# Altium project Tray2.PrjPcb
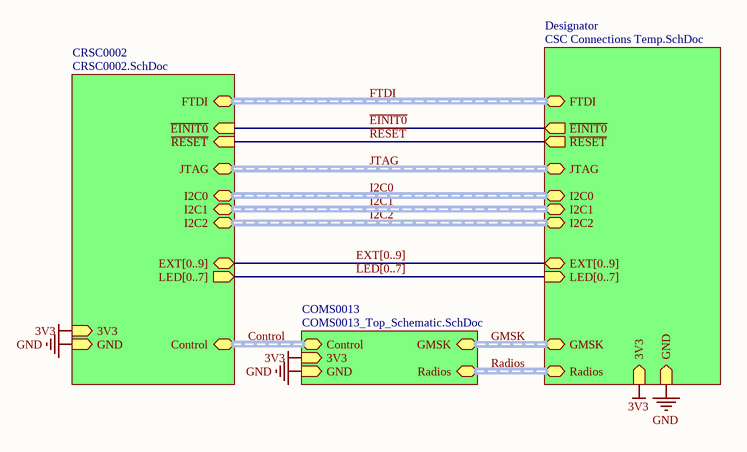
[diagram p0: Tray2.SchDoc]
8 sheets, 140 parts. Net scope: strictly hierarchical (ports join the sheet entries above them; power ports are local).
Board file: CSC 002B.PcbDoc
Sheets:
  Tray2.SchDoc
    CRSC0002 = CRSC0002.SchDoc
    COMS0013 = COMS0013_Top_Schematic.SchDoc
      D1 = COMS0003_DTMF.SchDoc
      D2 = COMS0003_DTMF.SchDoc
      Beacon = COMS0001_Beacon.SchDoc
      U_SwC_Main = COMS0004 SwC_Main.SchDoc
      A1 = COMS0002_AFSK.SchDoc
      A2 = COMS0002_AFSK.SchDoc
    Designator = CSC Connections Temp.SchDoc

## Sheet Tray2.SchDoc
size A4

### Sub-sheets
COMS0013 = COMS0013_Top_Schematic.SchDoc: GMSK (harness GMSK), Radios (harness Radios), Control (harness CommsControl), 3V3 (in), GND (in)
CRSC0002 = CRSC0002.SchDoc: ~{EINIT0} (in), ~{RESET} (in), I2C1 (harness I2C), I2C0 (harness I2C), I2C2 (harness I2C), JTAG (harness JTAG), Control (harness CommsControl), FTDI (harness FTDI), EXT[0..9] (bidir), LED[0..7] (out), 3V3 (in), GND (in)
Designator = CSC Connections Temp.SchDoc: JTAG (harness JTAG), FTDI (harness FTDI), I2C0 (harness I2C), I2C1 (harness I2C), I2C2 (harness I2C), GMSK (harness GMSK), Radios (harness Radios), ~{RESET} (out), ~{EINIT0} (out), LED[0..7] (in), EXT[0..9] (bidir), 3V3 (in), GND (in)

### Nets
3V3: sheet CRSC0002/3V3, sheet COMS0013/3V3, sheet Designator/3V3
GND: sheet CRSC0002/GND, sheet COMS0013/GND, sheet Designator/GND
~{EINIT0}: sheet CRSC0002/~{EINIT0}, sheet Designator/~{EINIT0}
~{RESET}: sheet CRSC0002/~{RESET}, sheet Designator/~{RESET}

### Buses and harness runs
bus EXT[0..9] = sheet CRSC0002/EXT[0..9] = sheet Designator/EXT[0..9]
bus LED[0..7] = sheet CRSC0002/LED[0..7] = sheet Designator/LED[0..7]
harness Control = sheet COMS0013/Control = sheet CRSC0002/Control
harness FTDI = sheet CRSC0002/FTDI = sheet Designator/FTDI
harness GMSK = sheet COMS0013/GMSK = sheet Designator/GMSK
harness I2C0 = sheet CRSC0002/I2C0 = sheet Designator/I2C0
harness I2C1 = sheet CRSC0002/I2C1 = sheet Designator/I2C1
harness I2C2 = sheet CRSC0002/I2C2 = sheet Designator/I2C2
harness JTAG = sheet CRSC0002/JTAG = sheet Designator/JTAG
harness Radios = sheet COMS0013/Radios = sheet Designator/Radios

## Sheet CRSC0002.SchDoc
size A3; PageSetup: Record=PageOptions|CenterHorizontal=True|CenterVertical=True|PrintScale=0.97|XCorrection=1.00|YCorrection=1.00|PrintKind=1|BorderSize=5000000|LeftOffset=0|BottomOffset=0|Orientation=2|PaperLength=2970|PaperWidth=2100|Scale=100|PaperSource=7|PrintQuality=1200|MediaType=1|DitherType=10|PaperKind=A4|PrintScaleMode=1
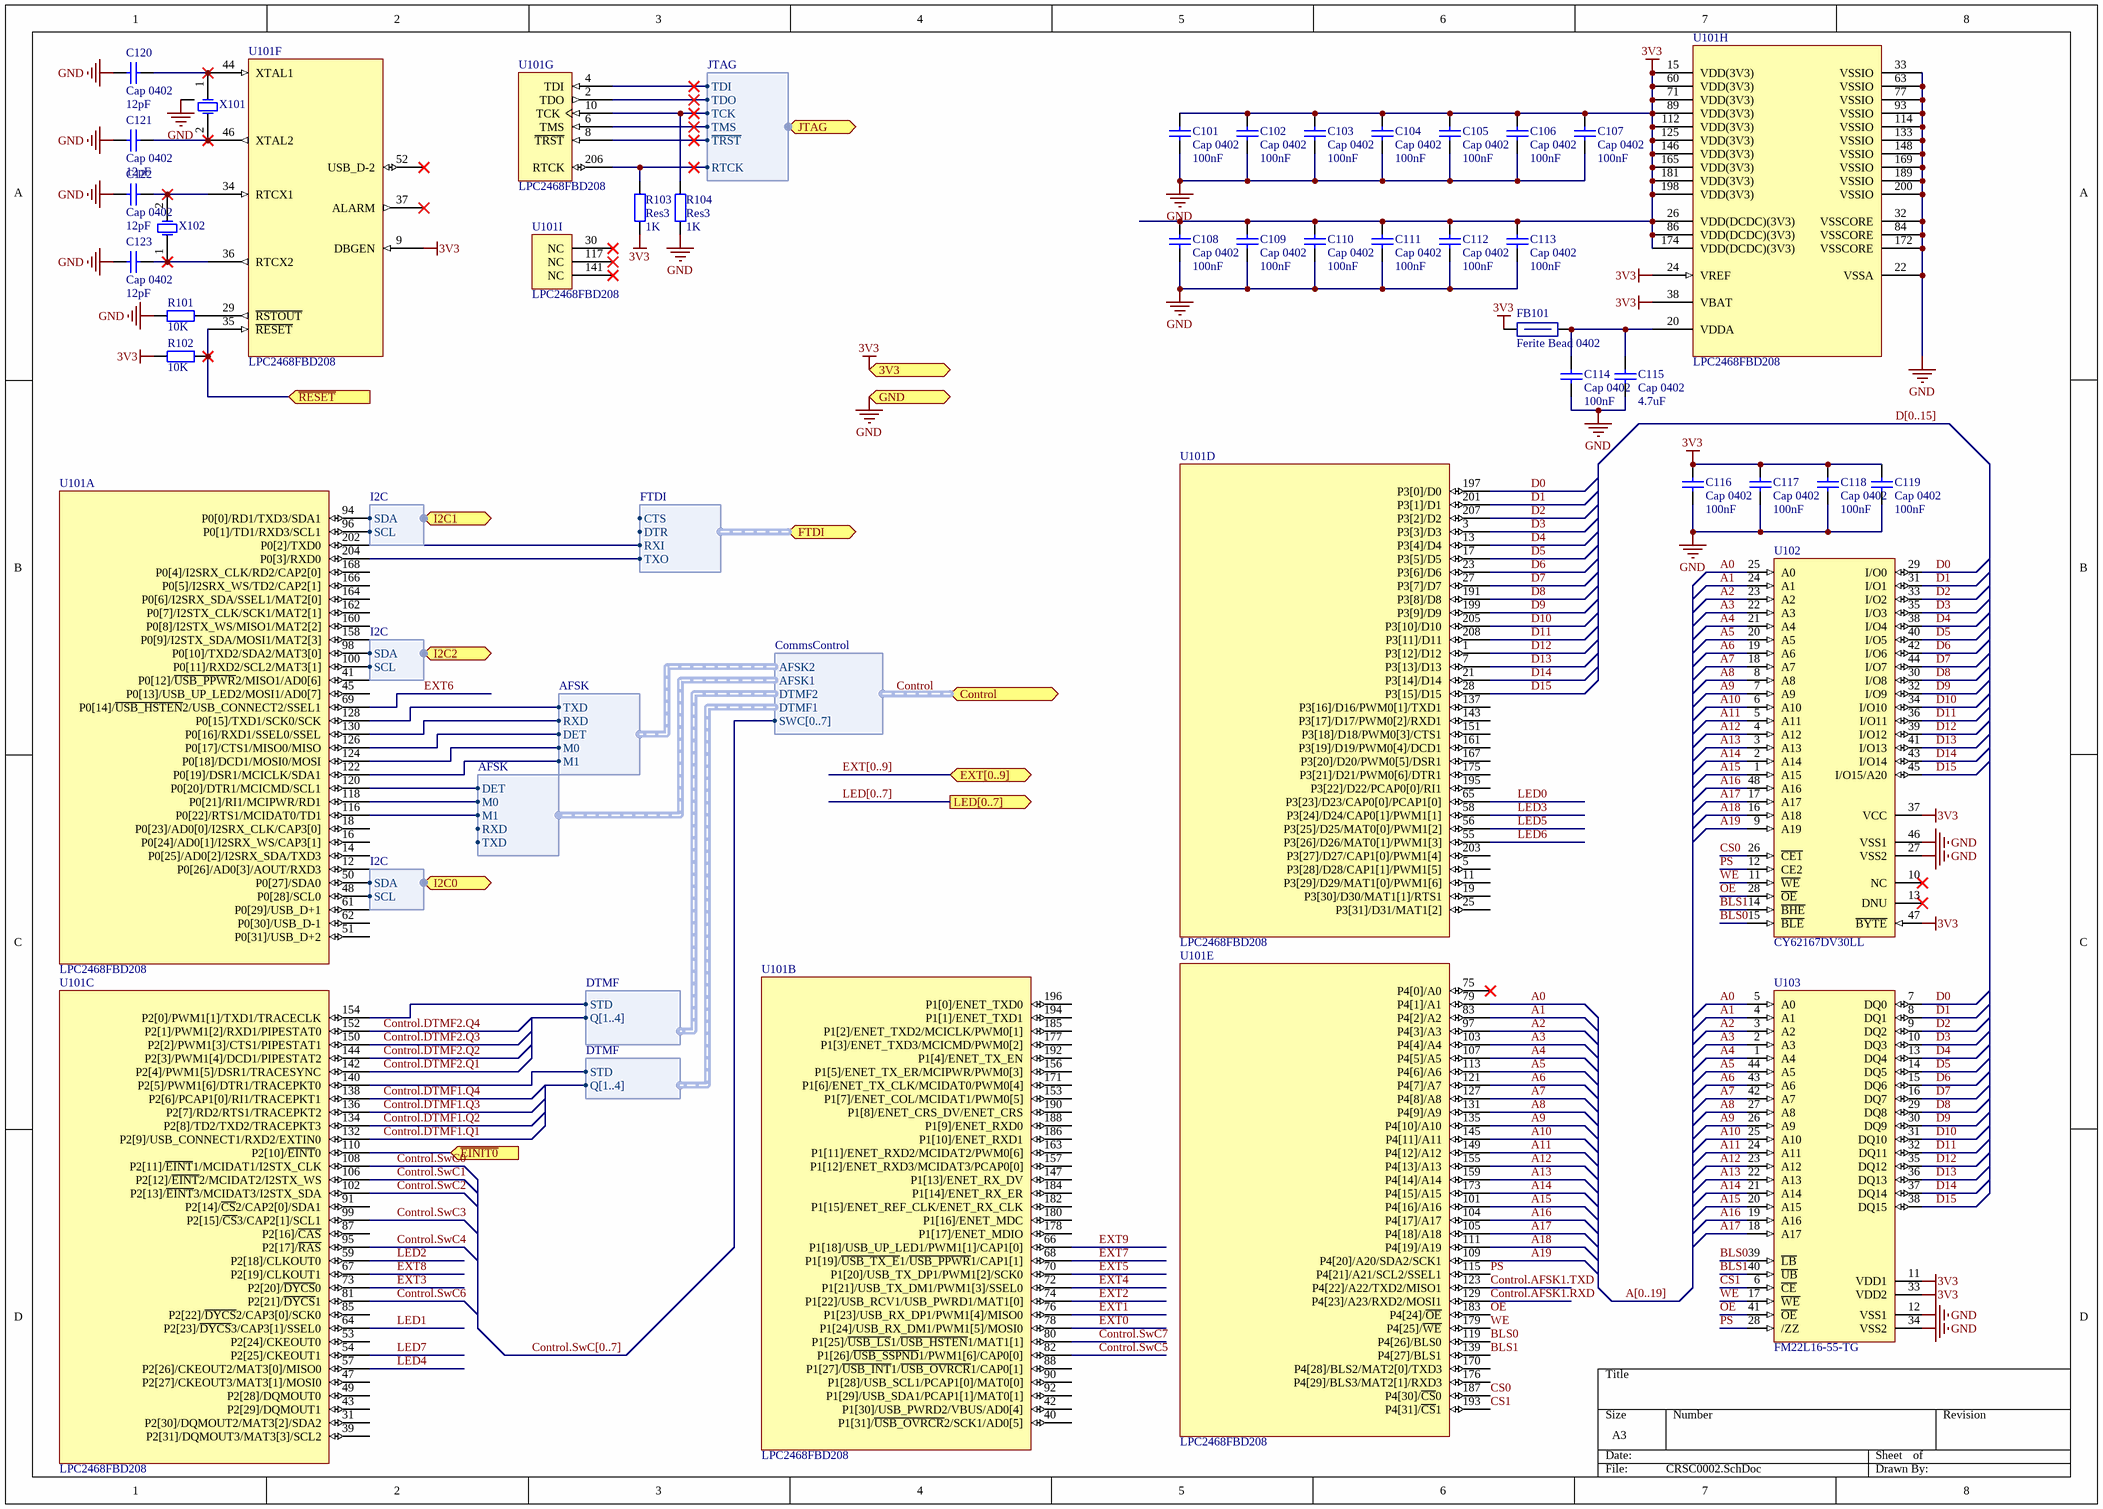
[diagram p1: CRSC0002.SchDoc]

### Parts
C101  Cap 0402  value 100nF  [CAPC1005X06L]
C102  Cap 0402  value 100nF  [CAPC1005X06L]
C103  Cap 0402  value 100nF  [CAPC1005X06L]
C104  Cap 0402  value 100nF  [CAPC1005X06L]
C105  Cap 0402  value 100nF  [CAPC1005X06L]
C106  Cap 0402  value 100nF  [CAPC1005X06L]
C107  Cap 0402  value 100nF  [CAPC1005X06L]
C108  Cap 0402  value 100nF  [CAPC1005X06L]
C109  Cap 0402  value 100nF  [CAPC1005X06L]
C110  Cap 0402  value 100nF  [CAPC1005X06L]
C111  Cap 0402  value 100nF  [CAPC1005X06L]
C112  Cap 0402  value 100nF  [CAPC1005X06L]
C113  Cap 0402  value 100nF  [CAPC1005X06L]
C114  Cap 0402  value 100nF  [CAPC1005X06L]
C115  Cap 0402  value 4.7uF  [CAPC1005X06L]
C116  Cap 0402  value 100nF  [CAPC1005X06L]
C117  Cap 0402  value 100nF  [CAPC1005X06L]
C118  Cap 0402  value 100nF  [CAPC1005X06L]
C119  Cap 0402  value 100nF  [CAPC1005X06L]
C120  Cap 0402  value 12pF  [CAPC1005X06L]
C121  Cap 0402  value 12pF  [CAPC1005X06L]
C122  Cap 0402  value 12pF  [CAPC1005X06L]
C123  Cap 0402  value 12pF  [CAPC1005X06L]
FB101  Ferite Bead 0402  [INDC1005X06L]
R101  value 10K  [RESC1005X06L]  (hidden comment: Res3)
R102  value 10K  [RESC1005X06L]  (hidden comment: Res3)
R103  Res3  value 1K  [RESC1005X06L]
R104  Res3  value 1K  [RESC1005X06L]
U101  LPC2468FBD208  [TSQFP50P3000X3000X160-208L]  (parts A,B,C,D,E,F,G,H,I of 9)
U102  CY62167DV30LL  [TSSOP50P2000X120-48L]
U103  FM22L16-55-TG  [TSOP80P1180X120-44L]
X101  Crystal Oscilator  [7M]  (value not drawn)
X102  Crystal Oscilator  [9H T10]  (value not drawn)

### Ports
3V3 (in), Control (harness CommsControl), EXT[0..9] (bidir), FTDI (harness FTDI), GND (in), I2C0 (harness I2C), I2C1 (harness I2C), I2C2 (harness I2C), JTAG (harness JTAG), LED[0..7] (out), ~{EINIT0} (in), ~{RESET} (in)

### Harnesses
I2C: SDA, SCL
JTAG: TDI, TDO, TCK, TMS, ~{TRST}, RTCK
AFSK: DET, M0, M1, RXD, TXD
DTMF: Q[1..4], STD
CommsControl: AFSK1, AFSK2, DTMF1, DTMF2, SWC[0..7]
FTDI: CTS, DTR, RXI, TXO

### Nets
3V3: C101.2 C102.2 C103.2 C104.2 C105.2 C106.2 C107.2 C108.2 C109.2 C110.2 C111.2 C112.2 C113.2 C116.2 C117.2 C118.2 C119.2 FB101.1 R102.2 R103.2 U101.9(DBGEN) U101.15(VDD(3V3)) U101.24(VREF) U101.26(VDD(DCDC)(3V3)) U101.38(VBAT) U101.60(VDD(3V3)) U101.71(VDD(3V3)) U101.86(VDD(DCDC)(3V3)) U101.89(VDD(3V3)) U101.112(VDD(3V3)) U101.125(VDD(3V3)) U101.146(VDD(3V3)) U101.165(VDD(3V3)) U101.174(VDD(DCDC)(3V3)) U101.181(VDD(3V3)) U101.198(VDD(3V3)) U102.37(VCC) U102.47(~{BYTE}) U103.11(VDD1) U103.33(VDD2) ; port 3V3
GND: C101.1 C102.1 C103.1 C104.1 C105.1 C106.1 C107.1 C108.1 C109.1 C110.1 C111.1 C112.1 C113.1 C114.1 C115.1 C116.1 C117.1 C118.1 C119.1 C120.2 C121.1 C122.2 C123.1 R101.2 R104.2 U101.22(VSSA) U101.32(VSSCORE) U101.33(VSSIO) U101.63(VSSIO) U101.77(VSSIO) U101.84(VSSCORE) U101.93(VSSIO) U101.114(VSSIO) U101.133(VSSIO) U101.148(VSSIO) U101.169(VSSIO) U101.172(VSSCORE) U101.189(VSSIO) U101.200(VSSIO) U102.27(VSS2) U102.46(VSS1) U103.12(VSS1) U103.34(VSS2) X101.3 ; port GND
A0: U101.79(P4[1]/A1) U102.25(A0) U103.5(A0)
A1: U101.83(P4[2]/A2) U102.24(A1) U103.4(A1)
A2: U101.97(P4[3]/A3) U102.23(A2) U103.3(A2)
A3: U101.103(P4[4]/A4) U102.22(A3) U103.2(A3)
A4: U101.107(P4[5]/A5) U102.21(A4) U103.1(A4)
A5: U101.113(P4[6]/A6) U102.20(A5) U103.44(A5)
A6: U101.121(P4[7]/A7) U102.19(A6) U103.43(A6)
A7: U101.127(P4[8]/A8) U102.18(A7) U103.42(A7)
A8: U101.131(P4[9]/A9) U102.8(A8) U103.27(A8)
A9: U101.135(P4[10]/A10) U102.7(A9) U103.26(A9)
A10: U101.145(P4[11]/A11) U102.6(A10) U103.25(A10)
A11: U101.149(P4[12]/A12) U102.5(A11) U103.24(A11)
A12: U101.155(P4[13]/A13) U102.4(A12) U103.23(A12)
A13: U101.159(P4[14]/A14) U102.3(A13) U103.22(A13)
A14: U101.173(P4[15]/A15) U102.2(A14) U103.21(A14)
A15: U101.101(P4[16]/A16) U102.1(A15) U103.20(A15)
A16: U101.104(P4[17]/A17) U102.48(A16) U103.19(A16)
A17: U101.105(P4[18]/A18) U102.17(A17) U103.18(A17)
A18: U101.111(P4[19]/A19) U102.16(A18)
A19: U101.109(P4[20]/A20/SDA2/SCK1) U102.9(A19)
BLS0: U101.119(P4[26]/BLS0) U102.15(~{BLE}) U103.39(~{LB})
BLS1: U101.139(P4[27]/BLS1) U102.14(~{BHE}) U103.40(~{UB})
Control.AFSK1.RXD: U101.129(P4[23]/A23/RXD2/MOSI1)
Control.AFSK1.TXD: U101.123(P4[22]/A22/TXD2/MISO1)
Control.DTMF1.Q1: U101.132(P2[9]/USB_CONNECT1/RXD2/EXTIN0)
Control.DTMF1.Q2: U101.134(P2[8]/TD2/TXD2/TRACEPKT3)
Control.DTMF1.Q3: U101.136(P2[7]/RD2/RTS1/TRACEPKT2)
Control.DTMF1.Q4: U101.138(P2[6]/PCAP1[0]/RI1/TRACEPKT1)
Control.DTMF2.Q1: U101.142(P2[4]/PWM1[5]/DSR1/TRACESYNC)
Control.DTMF2.Q2: U101.144(P2[3]/PWM1[4]/DCD1/PIPESTAT2)
Control.DTMF2.Q3: U101.150(P2[2]/PWM1[3]/CTS1/PIPESTAT1)
Control.DTMF2.Q4: U101.152(P2[1]/PWM1[2]/RXD1/PIPESTAT0)
Control.SwC0: U101.108(P2[11]/~{EINT}1/MCIDAT1/I2STX_CLK)
Control.SwC1: U101.106(P2[12]/~{EINT}2/MCIDAT2/I2STX_WS)
Control.SwC2: U101.102(P2[13]/~{EINT}3/MCIDAT3/I2STX_SDA)
Control.SwC3: U101.99(P2[15]/~{CS}3/CAP2[1]/SCL1)
Control.SwC4: U101.95(P2[17]/~{RAS})
Control.SwC5: U101.82(P1[26]/~{USB_SSPND}1/PWM1[6]/CAP0[0])
Control.SwC6: U101.81(P2[21]/~{DYCS}1)
Control.SwC7: U101.80(P1[25]/~{USB_LS}1/~{USB_HSTEN}1/MAT1[1])
CS0: U101.187(P4[30]/~{CS}0) U102.26(~{CE1})
CS1: U101.193(P4[31]/~{CS}1) U103.6(~{CE})
D0: U101.197(P3[0]/D0) U102.29(I/O0) U103.7(DQ0)
D1: U101.201(P3[1]/D1) U102.31(I/O1) U103.8(DQ1)
D2: U101.207(P3[2]/D2) U102.33(I/O2) U103.9(DQ2)
D3: U101.3(P3[3]/D3) U102.35(I/O3) U103.10(DQ3)
D4: U101.13(P3[4]/D4) U102.38(I/O4) U103.13(DQ4)
D5: U101.17(P3[5]/D5) U102.40(I/O5) U103.14(DQ5)
D6: U101.23(P3[6]/D6) U102.42(I/O6) U103.15(DQ6)
D7: U101.27(P3[7]/D7) U102.44(I/O7) U103.16(DQ7)
D8: U101.191(P3[8]/D8) U102.30(I/O8) U103.29(DQ8)
D9: U101.199(P3[9]/D9) U102.32(I/O9) U103.30(DQ9)
D10: U101.205(P3[10]/D10) U102.34(I/O10) U103.31(DQ10)
D11: U101.208(P3[11]/D11) U102.36(I/O11) U103.32(DQ11)
D12: U101.1(P3[12]/D12) U102.39(I/O12) U103.35(DQ12)
D13: U101.7(P3[13]/D13) U102.41(I/O13) U103.36(DQ13)
D14: U101.21(P3[14]/D14) U102.43(I/O14) U103.37(DQ14)
D15: U101.28(P3[15]/D15) U102.45(I/O15/A20) U103.38(DQ15)
DTMF.STD: U101.154(P2[0]/PWM1[1]/TXD1/TRACECLK) ; harness DTMF.STD
DTMF.STD: U101.140(P2[5]/PWM1[6]/DTR1/TRACEPKT0) ; harness DTMF.STD  [a separate net that carries the same name]
~{EINIT0}: U101.110(P2[10]/~{EINT}0) ; port ~{EINIT0}
EXT0: U101.78(P1[24]/USB_RX_DM1/PWM1[5]/MOSI0)
EXT1: U101.76(P1[23]/USB_RX_DP1/PWM1[4]/MISO0)
EXT2: U101.74(P1[22]/USB_RCV1/USB_PWRD1/MAT1[0])
EXT3: U101.73(P2[20]/~{DYCS}0)
EXT4: U101.72(P1[21]/USB_TX_DM1/PWM1[3]/SSEL0)
EXT5: U101.70(P1[20]/USB_TX_DP1/PWM1[2]/SCK0)
EXT6: U101.69(P0[14]/~{USB_HSTEN}2/USB_CONNECT2/SSEL1)
EXT7: U101.68(P1[19]/~{USB_TX_E}1/~{USB_PPWR}1/CAP1[1])
EXT8: U101.67(P2[19]/CLKOUT1)
EXT9: U101.66(P1[18]/USB_UP_LED1/PWM1[1]/CAP1[0])
FTDI.RXI: U101.202(P0[2]/TXD0) ; port FTDI.RXI
FTDI.TXO: U101.204(P0[3]/RXD0) ; port FTDI.TXO
I2C0.SCL: U101.48(P0[28]/SCL0) ; port I2C0.SCL
I2C0.SDA: U101.50(P0[27]/SDA0) ; port I2C0.SDA
I2C1.SCL: U101.96(P0[1]/TD1/RXD3/SCL1) ; port I2C1.SCL
I2C1.SDA: U101.94(P0[0]/RD1/TXD3/SDA1) ; port I2C1.SDA
I2C2.SCL: U101.100(P0[11]/RXD2/SCL2/MAT3[1]) ; port I2C2.SCL
I2C2.SDA: U101.98(P0[10]/TXD2/SDA2/MAT3[0]) ; port I2C2.SDA
JTAG.RTCK: R103.1 U101.206(RTCK) ; port JTAG.RTCK
JTAG.~{TRST}: U101.8(~{TRST}) ; port JTAG.~{TRST}
JTAG.TCK: R104.1 U101.10(TCK) ; port JTAG.TCK
JTAG.TDI: U101.4(TDI) ; port JTAG.TDI
JTAG.TDO: U101.2(TDO) ; port JTAG.TDO
JTAG.TMS: U101.6(TMS) ; port JTAG.TMS
LED0: U101.65(P3[23]/D23/CAP0[0]/PCAP1[0])
LED1: U101.64(P2[23]/~{DYCS}3/CAP3[1]/SSEL0)
LED2: U101.59(P2[18]/CLKOUT0)
LED3: U101.58(P3[24]/D24/CAP0[1]/PWM1[1])
LED4: U101.57(P2[26]/CKEOUT2/MAT3[0]/MISO0)
LED5: U101.56(P3[25]/D25/MAT0[0]/PWM1[2])
LED6: U101.55(P3[26]/D26/MAT0[1]/PWM1[3])
LED7: U101.54(P2[25]/CKEOUT1)
OE: U101.183(P4[24]/~{OE}) U102.28(~{OE}) U103.41(~{OE})
PS: U101.115(P4[21]/A21/SCL2/SSEL1) U102.12(CE2) U103.28(/ZZ)
~{RESET}: R102.1 U101.35(~{RESET}) ; port ~{RESET}
WE: U101.179(P4[25]/~{WE}) U102.11(~{WE}) U103.17(~{WE})
NetC114_2: C114.2 C115.2 FB101.2 U101.20(VDDA)
NetC120_1: C120.1 U101.44(XTAL1) X101.1(OSC1)
NetC121_2: C121.2 U101.46(XTAL2) X101.2(OSC2)
NetC122_1: C122.1 U101.34(RTCX1) X102.2(OSC2)
NetC123_2: C123.2 U101.36(RTCX2) X102.1(OSC1)
NetR101_1: R101.1 U101.29(~{RSTOUT})
NetU101_116: U101.116(P0[22]/RTS1/MCIDAT0/TD1) ; harness AFSK.M1
NetU101_118: U101.118(P0[21]/RI1/MCIPWR/RD1) ; harness AFSK.M0
NetU101_120: U101.120(P0[20]/DTR1/MCICMD/SCL1) ; harness AFSK.DET
NetU101_122: U101.122(P0[19]/DSR1/MCICLK/SDA1) ; harness AFSK.M1
NetU101_124: U101.124(P0[18]/DCD1/MOSI0/MOSI) ; harness AFSK.M0
NetU101_126: U101.126(P0[17]/CTS1/MISO0/MISO) ; harness AFSK.DET
NetU101_128: U101.128(P0[15]/TXD1/SCK0/SCK) ; harness AFSK.TXD
NetU101_130: U101.130(P0[16]/RXD1/SSEL0/SSEL) ; harness AFSK.RXD

Not connected (* = marked no-connect by the designer): U101 5(P3[28]/D28/CAP1[1]/PWM1[5]) 11(P3[29]/D29/MAT1[0]/PWM1[6]) 12(P0[26]/AD0[3]/AOUT/RXD3) 14(P0[25]/AD0[2]/I2SRX_SDA/TXD3) 16(P0[24]/AD0[1]/I2SRX_WS/CAP3[1]) 18(P0[23]/AD0[0]/I2SRX_CLK/CAP3[0]) 19(P3[30]/D30/MAT1[1]/RTS1) 25(P3[31]/D31/MAT1[2]) 30(NC)* 31(P2[30]/DQMOUT2/MAT3[2]/SDA2) 37(ALARM)* 39(P2[31]/DQMOUT3/MAT3[3]/SCL2) 40(P1[31]/~{USB_OVRCR}2/SCK1/AD0[5]) 41(P0[12]/~{USB_PPWR}2/MISO1/AD0[6]) 42(P1[30]/USB_PWRD2/VBUS/AD0[4]) 43(P2[29]/DQMOUT1) 45(P0[13]/USB_UP_LED2/MOSI1/AD0[7]) 47(P2[27]/CKEOUT3/MAT3[1]/MOSI0) 49(P2[28]/DQMOUT0) 51(P0[31]/USB_D+2) 52(USB_D-2)* 53(P2[24]/CKEOUT0) 61(P0[29]/USB_D+1) 62(P0[30]/USB_D-1) 75(P4[0]/A0)* 85(P2[22]/~{DYCS}2/CAP3[0]/SCK0) 87(P2[16]/~{CAS}) 88(P1[27]/~{USB_INT}1/~{USB_OVRCR}1/CAP0[1]) 90(P1[28]/USB_SCL1/PCAP1[0]/MAT0[0]) 91(P2[14]/~{CS}2/CAP2[0]/SDA1) 92(P1[29]/USB_SDA1/PCAP1[1]/MAT0[1]) 117(NC)* 137(P3[16]/D16/PWM0[1]/TXD1) 141(NC)* 143(P3[17]/D17/PWM0[2]/RXD1) 147(P1[13]/ENET_RX_DV) 151(P3[18]/D18/PWM0[3]/CTS1) 153(P1[7]/ENET_COL/MCIDAT1/PWM0[5]) 156(P1[5]/ENET_TX_ER/MCIPWR/PWM0[3]) 157(P1[12]/ENET_RXD3/MCIDAT3/PCAP0[0]) 158(P0[9]/I2STX_SDA/MOSI1/MAT2[3]) 160(P0[8]/I2STX_WS/MISO1/MAT2[2]) 161(P3[19]/D19/PWM0[4]/DCD1) 162(P0[7]/I2STX_CLK/SCK1/MAT2[1]) 163(P1[11]/ENET_RXD2/MCIDAT2/PWM0[6]) 164(P0[6]/I2SRX_SDA/SSEL1/MAT2[0]) 166(P0[5]/I2SRX_WS/TD2/CAP2[1]) 167(P3[20]/D20/PWM0[5]/DSR1) 168(P0[4]/I2SRX_CLK/RD2/CAP2[0]) 170(P4[28]/BLS2/MAT2[0]/TXD3) 171(P1[6]/ENET_TX_CLK/MCIDAT0/PWM0[4]) 175(P3[21]/D21/PWM0[6]/DTR1) 176(P4[29]/BLS3/MAT2[1]/RXD3) 177(P1[3]/ENET_TXD3/MCICMD/PWM0[2]) 178(P1[17]/ENET_MDIO) 180(P1[16]/ENET_MDC) 182(P1[15]/ENET_REF_CLK/ENET_RX_CLK) 184(P1[14]/ENET_RX_ER) 185(P1[2]/ENET_TXD2/MCICLK/PWM0[1]) 186(P1[10]/ENET_RXD1) 188(P1[9]/ENET_RXD0) 190(P1[8]/ENET_CRS_DV/ENET_CRS) 192(P1[4]/ENET_TX_EN) 194(P1[1]/ENET_TXD1) 195(P3[22]/D22/PCAP0[0]/RI1) 196(P1[0]/ENET_TXD0) 203(P3[27]/D27/CAP1[0]/PWM1[4]); U102 10(NC)* 13(DNU)*

### Buses and harness runs
bus A[0..19]
bus Control.SwC[0..7]
bus D[0..15]
bus EXT[0..9] = port EXT[0..9]
bus LED[0..7] = port LED[0..7]
harness Control = port Control

### Library data of the parts
C101-C123 = Cap 0402: Capacitor; Published: 8-Jun-2000; LatestRevisionDate: 17-Jul-2002; LatestRevisionNote: Re-released for DXP Platform.; PackageReference: RAD-0.3; Publisher: Altium Limited; PackageDescription: Radial Cap, Thru-Hole; 2 Leads; 0.3 in Pin Spacing
FB101 = FB_0402: Ferite Bead : 0402; Published: 8-Jun-2000; LatestRevisionDate: 29-May-2009; LatestRevisionNote: IPC-7351 Footprint Added.; PackageReference: J1-0603; Publisher: Altium Limited; PackageDescription: Chip Resistor
R101-R104 = Res3: Resistor; Published: 8-Jun-2000; LatestRevisionDate: 29-May-2009; LatestRevisionNote: IPC-7351 Footprint Added.; PackageReference: J1-0603; Publisher: Altium Limited; PackageDescription: Chip Resistor
U101 = LPC2468FBD208: ARM7 16/32-Bit Microcontroller, 512KB Flash, 98KB RAM, 208-Lead LQFP; Code_IEC: 136E30; Published: 17-Aug-2007; DatasheetVersion: rev.01, Jul-2007; PackageVersion: Feb-2003; PackageReference: SOT459-1; Publisher: Altium Limited; PackageDescription: 208-Pin Plastic Low Profile Quad Flat Pack, LQFP208; Code_JEDEC: MS-026; ComponentLink1Description: Manufacturer Link; ComponentLink1URL: http://www.nxp.com/; ComponentLink2Description: Datasheet; ComponentLink2URL: http://www.standardics.nxp.com/products/lpc2000/datasheet/lpc2468.pdf
U102 = CY62167DV30LL: 16-Mbit (1M x 16) Static RAM; ColumnAddress: A0-A9; Publisher: Altium Limited; ComponentLink1Description: Manufacturer Link; ComponentLink2Description: Datasheet
U103 = FM22L16-55-TG: FRAM, 2MB, 3V, 60NS, 44TSOP2; ColumnAddress: A0-A9; LatestRevisionDate: 13-Apr-2006; DatasheetVersion: rev1.1, Feb-2004; PackageReference: TSOP2-44_M; PackageDescription: 44-Pin Small Outline Package 0.8 mm Pitch; ComponentLink1Description: Manufacturer Link; ComponentLink2Description: Datasheet
X101 = C.O. 4pins: Crystal Oscillator; Value: 12.000MHz; Published: 8-Jun-2000; LatestRevisionDate: 17-Jul-2002; LatestRevisionNote: Re-released for DXP Platform.; PackageReference: R38; Publisher: Altium Limited
X102 = C.O. 2pins: Crystal Oscillator; Value: 12.000MHz; Published: 8-Jun-2000; LatestRevisionDate: 17-Jul-2002; LatestRevisionNote: Re-released for DXP Platform.; PackageReference: R38; Publisher: Altium Limited

## Sheet COMS0013_Top_Schematic.SchDoc: Communications Top Level Schematic
size A3; Engineer: A. Shaw; DocumentNumber: COMS0013; Version: 1.0; Description: Overview of the communications subsystem
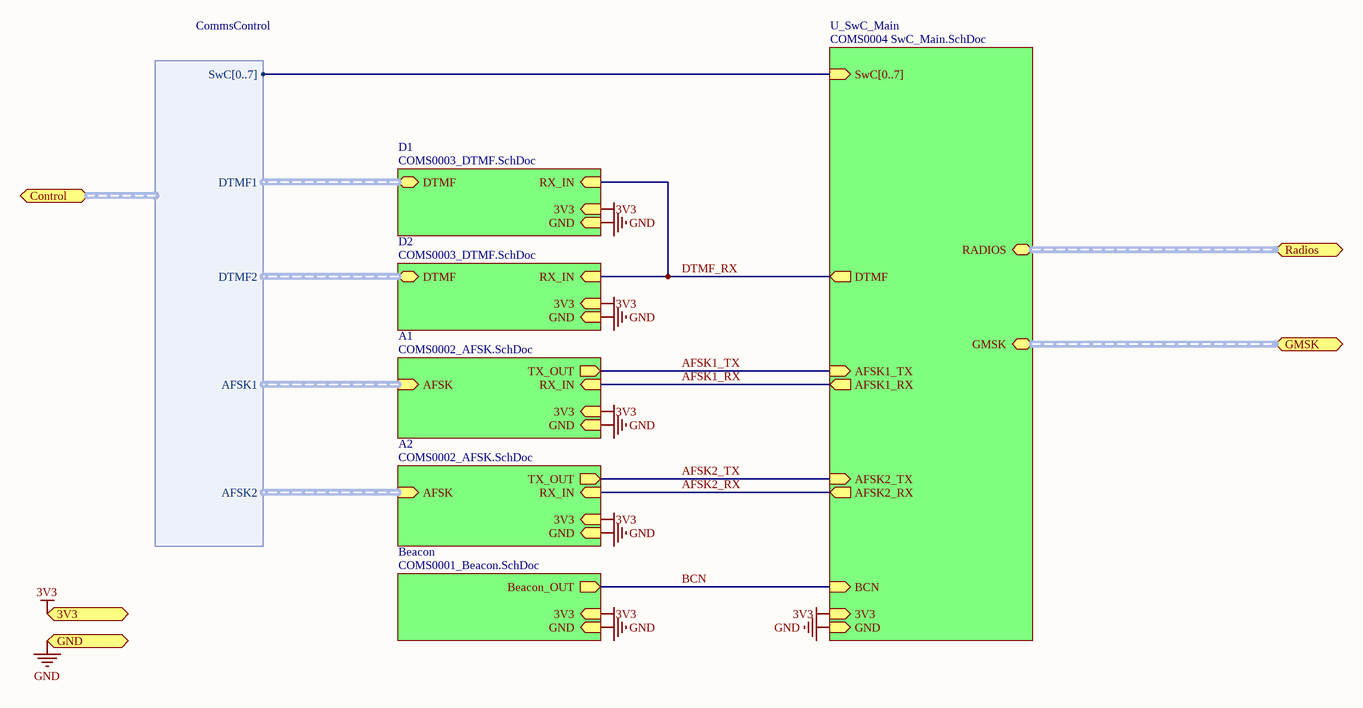
[diagram p2: COMS0013_Top_Schematic.SchDoc]

### Sub-sheets
A1 = COMS0002_AFSK.SchDoc: RX_IN (in), AFSK (harness AFSK), TX_OUT (out), 3V3 (in), GND (in)
A2 = COMS0002_AFSK.SchDoc: RX_IN (in), AFSK (harness AFSK), TX_OUT (out), 3V3 (in), GND (in)
Beacon = COMS0001_Beacon.SchDoc: Beacon_OUT (out), 3V3 (in), GND (in)
D1 = COMS0003_DTMF.SchDoc: RX_IN (in), DTMF (harness DTMF), 3V3 (in), GND (in)
D2 = COMS0003_DTMF.SchDoc: RX_IN (in), DTMF (harness DTMF), 3V3 (in), GND (in)
U_SwC_Main = COMS0004 SwC_Main.SchDoc: BCN (in), AFSK1_TX (in), AFSK2_TX (in), AFSK1_RX (out), AFSK2_RX (out), DTMF (out), SwC[0..7] (in), RADIOS (harness Radios), GMSK (harness GMSK), 3V3 (in), GND (in)

### Ports
3V3 (in), Control (harness CommsControl), GMSK (harness GMSK), GND (in), Radios (harness Radios)

### Harnesses
CommsControl: DTMF1, DTMF2, AFSK1, AFSK2, SwC[0..7]

### Nets
3V3: port 3V3, sheet D1/3V3, sheet D2/3V3, sheet Beacon/3V3, sheet U_SwC_Main/3V3, sheet A1/3V3, sheet A2/3V3
GND: port GND, sheet D1/GND, sheet D2/GND, sheet Beacon/GND, sheet U_SwC_Main/GND, sheet A1/GND, sheet A2/GND
AFSK1_RX: sheet U_SwC_Main/AFSK1_RX, sheet A1/RX_IN
AFSK1_TX: sheet U_SwC_Main/AFSK1_TX, sheet A1/TX_OUT
AFSK2_RX: sheet U_SwC_Main/AFSK2_RX, sheet A2/RX_IN
AFSK2_TX: sheet U_SwC_Main/AFSK2_TX, sheet A2/TX_OUT
BCN: sheet Beacon/Beacon_OUT, sheet U_SwC_Main/BCN
DTMF_RX: sheet D1/RX_IN, sheet D2/RX_IN, sheet U_SwC_Main/DTMF

### Buses and harness runs
harness port GMSK = sheet U_SwC_Main/GMSK
harness port Radios = sheet U_SwC_Main/RADIOS

### Notes on the sheet
- Title
- Description:
- Size:
- Author:
- Date:
- A3
- Time:
- Version
- Sheet:
- Drawing No.:
- of
- File:

## Sheet COMS0003_DTMF.SchDoc: BLUEsat DTMF receiver
size A3; DrawnBy: Thomas Fisk; Engineer: T. FISK; Organization: BLUEsat Project; Address1: Room 419; Address2: School of EE&T; Address3: UNSW, NSW 2052; Address4: Australia; DocumentNumber: COMS0003; SheetNumber: 1; SheetTotal: 1; Description: DTMF decoder for telecommand interface; Version: 1.0
Used 2 times, as channels COMS0013/D1, COMS0013/D2. Parts and nets are listed once, with the designators drawn on the sheet.
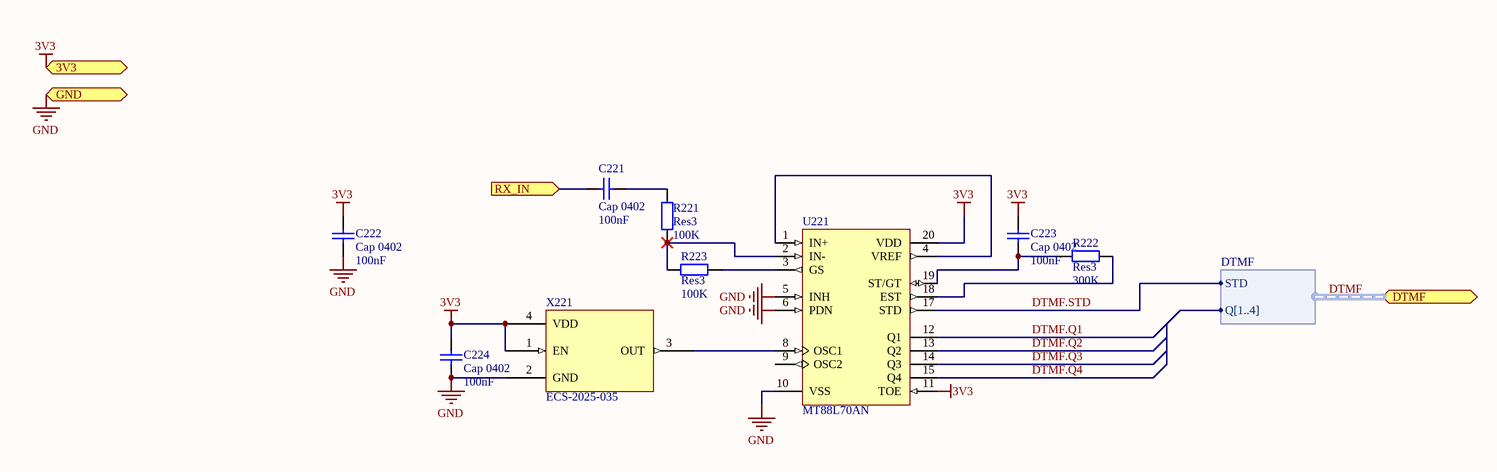
[diagram p3: COMS0003_DTMF.SchDoc]

### Parts
C221  Cap 0402  value 100nF  [CAPC1005X06L]
C222  Cap 0402  value 100nF  [CAPC1005X06L]
C223  Cap 0402  value 100nF  [CAPC1005X06L]
C224  Cap 0402  value 100nF  [CAPC1005X06L]
R221  Res3  value 100K  [RESC1005X06L]
R222  Res3  value 300K  [RESC1005X06L]
R223  Res3  value 100K  [RESC1005X06L]
U221  MT88L70AN  [TSSOP20]
X221  ECS-2025-035  [ECS-2025]

### Ports
3V3 (in), DTMF (harness DTMF), GND (in), RX_IN (in)

### Harnesses
DTMF: STD, Q[1..4]

### Nets
3V3: C222.2 C223.1 C224.1 U221.11(TOE) U221.20(VDD) X221.1(EN) X221.4(VDD) ; port 3V3
GND: C222.1 C224.2 U221.5(INH) U221.6(PDN) U221.10(VSS) X221.2(GND) ; port GND
DTMF.Q1: U221.12(Q1)
DTMF.Q2: U221.13(Q2)
DTMF.Q3: U221.14(Q3)
DTMF.Q4: U221.15(Q4)
DTMF.STD: U221.17(STD) ; port DTMF.STD
RX_IN: C221.2 ; port RX_IN
NetC221_1: C221.1 R221.1
NetC223_2: C223.2 R222.1 U221.19(ST/GT)
NetR221_2: R221.2 R223.1 U221.2(IN-)
NetR222_2: R222.2 U221.18(EST)
NetR223_2: R223.2 U221.3(GS)
NetU221_1: U221.1(IN+) U221.4(VREF)
NetU221_8: U221.8(OSC1) X221.3(OUT)

Not connected (* = marked no-connect by the designer): U221 9(OSC2)

### Channels
COMS0013/D1: designators end in .A; ports 3V3=3V3 GND=GND RX_IN=DTMF_RX
COMS0013/D2: designators end in .B; ports 3V3=3V3 GND=GND RX_IN=DTMF_RX

### Buses and harness runs
harness DTMF = port DTMF

### Notes on the sheet
- Title
- Description:
- Size:
- Author:
- Date:
- A3
- Time:
- Version
- Sheet:
- Drawing No.:
- of
- File:

### Library data of the parts
C221-C224 = Cap 0402: Capacitor; Published: 8-Jun-2000; LatestRevisionDate: 17-Jul-2002; LatestRevisionNote: Re-released for DXP Platform.; PackageReference: RAD-0.3; Publisher: Altium Limited; PackageDescription: Radial Cap, Thru-Hole; 2 Leads; 0.3 in Pin Spacing
R221-R223 = Res3: Resistor; Published: 8-Jun-2000; LatestRevisionDate: 29-May-2009; LatestRevisionNote: IPC-7351 Footprint Added.; PackageReference: J1-0603; Publisher: Altium Limited; PackageDescription: Chip Resistor
U221 = MT88L70AN: 3 Volt Integrated DTMF Receiver; Published: 8-Jun-2000; LatestRevisionDate: 13-Apr-2006; LatestRevisionNote: IPC-7351 Footprint Added.; DatasheetVersion: Issue 4 March 1997; PackageVersion: 1997; PackageReference: SOIC18; Publisher: Altium Limited; PackageDescription: 18-Pin Small Outline Integrated Circuit 1.27 mm Pitch; Code_JEDEC: MS-013-AB; ComponentLink1Description: Manufacturer Link; ComponentLink1URL: http://products.zarlink.com; ComponentLink2Description: Datasheet; ComponentLink2URL: http://assets.zarlink.com/DS/zarlink_MT88L70_MAY_05.pdf; Supplier 1: Allied; Supplier Part Number 1: 090-SPEC
X221 = ECS-2025-035: SMD Clock Oscillator, 3.579545MHz

## Sheet COMS0001_Beacon.SchDoc: BLUEsat Beacon
size A3; Author: Daniel Jedrychowski; Engineer: D. JEDRYCHOWSKI; Organization: BLUEsat Project; Address1: Room 419; Address2: School of EE&T; Address3: UNSW, NSW 2052; Address4: Australia; DocumentNumber: COMS0001; SheetNumber: 1; SheetTotal: 1; Description: Morse code continuous wave beacon based on EPROM; Version: 1.1
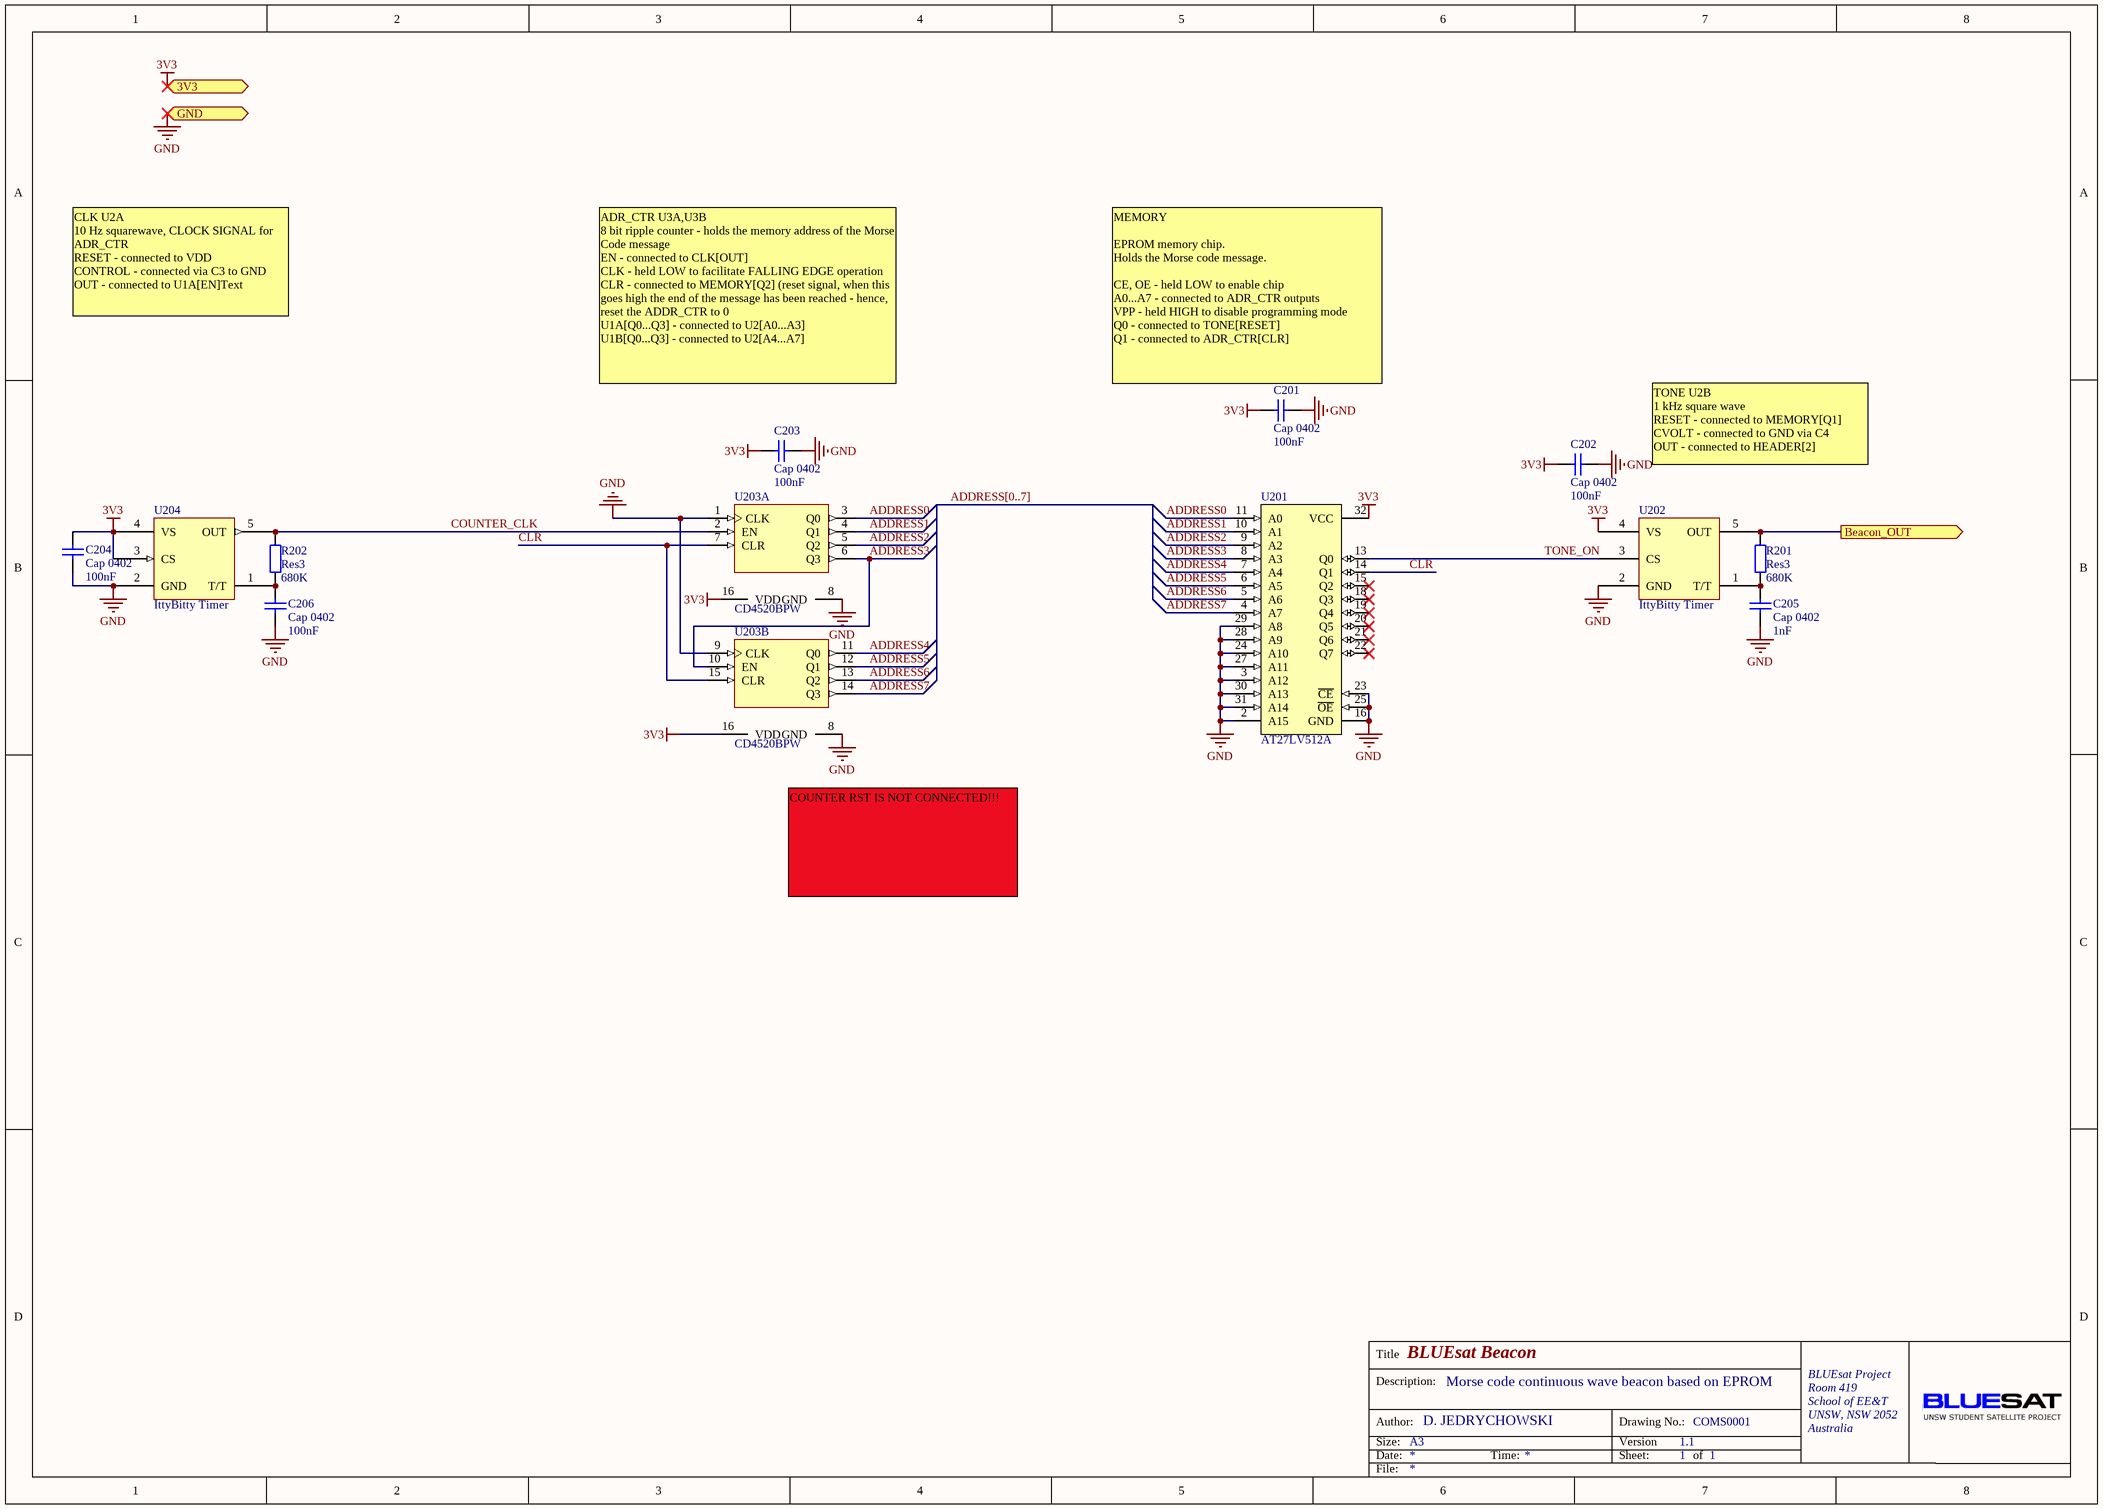
[diagram p4: COMS0001_Beacon.SchDoc]

### Parts
C201  Cap 0402  value 100nF  [CAPC1005X06L]
C202  Cap 0402  value 100nF  [CAPC1005X06L]
C203  Cap 0402  value 100nF  [CAPC1005X06L]
C204  Cap 0402  value 100nF  [CAPC1005X06L]
C205  Cap 0402  value 1nF  [CAPC1005X06L]
C206  Cap 0402  value 100nF  [CAPC1005X06L]
R201  Res3  value 680K  [RESC1005X06L]
R202  Res3  value 680K  [RESC1005X06L]
U201  AT27LV512A  [PLCC7*9]
U202  IttyBitty Timer  [SOT23-5]
U203  CD4520BPW  [TSSOP16]  (parts A,B of 2)
U204  IttyBitty Timer  [SOT23-5]

### Ports
3V3 (in), Beacon_OUT (out), GND (in)

### Nets
3V3: C201.1 C202.1 C203.1 C204.2 U201.32(VCC) U202.4(VS) U203.16(VDD) U204.3(CS) U204.4(VS) ; port 3V3
GND: C201.2 C202.2 C203.2 C204.1 C205.1 C206.1 U201.2(A15) U201.3(A12) U201.16(GND) U201.23(~{CE}) U201.24(A10) U201.25(~{OE}) U201.27(A11) U201.28(A9) U201.29(A8) U201.30(A13) U201.31(A14) U202.2(GND) U203.1(CLK) U203.8(GND) U203.9(CLK) U204.2(GND) ; port GND
ADDRESS0: U201.11(A0) U203.3(Q0)
ADDRESS1: U201.10(A1) U203.4(Q1)
ADDRESS2: U201.9(A2) U203.5(Q2)
ADDRESS3: U201.8(A3) U203.6(Q3) U203.10(EN)
ADDRESS4: U201.7(A4) U203.11(Q0)
ADDRESS5: U201.6(A5) U203.12(Q1)
ADDRESS6: U201.5(A6) U203.13(Q2)
ADDRESS7: U201.4(A7) U203.14(Q3)
BCN: R201.1 U202.5(OUT) ; port Beacon_OUT
CLR: U201.14(Q1) U203.7(CLR) U203.15(CLR)
COUNTER_CLK: R202.1 U203.2(EN) U204.5(OUT)
TONE_ON: U201.13(Q0) U202.3(CS)
NetC205_2: C205.2 R201.2 U202.1(T/T)
NetC206_2: C206.2 R202.2 U204.1(T/T)

Not connected (* = marked no-connect by the designer): U201 15(Q2)* 18(Q3)* 19(Q4)* 20(Q5)* 21(Q6)* 22(Q7)*

### Buses and harness runs
bus ADDRESS[0..7]

### Notes on the sheet
- CLK U2A
  10 Hz squarewave, CLOCK SIGNAL for ADR_CTR
  RESET - connected to VDD
  CONTROL - connected via C3 to GND
  OUT - connected to U1A[EN]Text
- ADR_CTR U3A,U3B
  8 bit ripple counter - holds the memory address of the Morse Code message
  EN - connected to CLK[OUT]
  CLK - held LOW to facilitate FALLING EDGE operation
  CLR - connected to MEMORY[Q2] (reset signal, when this goes high the end of the message has been reached - hence, reset the ADDR_CTR to 0
  U1A[Q0...Q3] - connected to U2[A0...A3]
  U1B[Q0...Q3] - connected to U2[A4...A7]
- (near C201) MEMORY
  EPROM memory chip.
  Holds the Morse code message.
  CE, OE - held LOW to enable chip
  A0...A7 - connected to ADR_CTR outputs
  VPP - held HIGH to disable programming mode
  Q0 - connected to TONE[RESET]
  Q1 - connected to ADR_CTR[CLR]
- TONE U2B
  1 kHz square wave
  RESET - connected to MEMORY[Q1]
  CVOLT - connected to GND via C4
  OUT - connected to HEADER[2]
- COUNTER RST IS NOT CONNECTED!!!
- Title
- Description:
- Size:
- Author:
- Date:
- A3
- Time:
- Version
- Sheet:
- Drawing No.:
- of
- File:

### Library data of the parts
C201-C206 = Cap 0402: Capacitor; Published: 8-Jun-2000; LatestRevisionDate: 17-Jul-2002; LatestRevisionNote: Re-released for DXP Platform.; PackageReference: RAD-0.3; Publisher: Altium Limited; PackageDescription: Radial Cap, Thru-Hole; 2 Leads; 0.3 in Pin Spacing
R201 R202 = Res3: Resistor; Published: 8-Jun-2000; LatestRevisionDate: 29-May-2009; LatestRevisionNote: IPC-7351 Footprint Added.; PackageReference: J1-0603; Publisher: Altium Limited; PackageDescription: Chip Resistor
U201 = AT27LV512A: 512 Kbit (32Kb X 8) UV EPROM and OTP EPROM; Published: 24-Aug-2001; LatestRevisionDate: 06-Jun-2005; LatestRevisionNote: Stylized 3D Model Added.; DatasheetVersion: Jul-1998; PackageVersion: Jan-2003; PackageReference: PDIP28; Publisher: Altium Limited; PackageDescription: DIP; 28 Leads; Row Spacing 15.24 mm; Pitch 2.54 mm; ComponentLink1Description: Manufacturer Link; ComponentLink1URL: http://www.st.com/; ComponentLink2Description: Datasheet; ComponentLink2URL: http://www.st.com/stonline/products/literature/ds/2384/m27c256b.pdf; Supplier 1: Digi-Key; Supplier Part Number 1: AT27LV256A-70RC-ND
U202 U204 = MIC1557: Miniature Astable Timer Chip; Supplier: Farnell; Supplier Part Number: 1517241
U203 = CD4520BPW: Dual Binary Up-Counter; Supplier 1: Farnell; Supplier Part Number 1: 1752815

## Sheet COMS0004 SwC_Main.SchDoc: BLUEsat Switching Circuit Overview
size A3; Engineer: D. JEDRYCHOWSKI; Organization: BLUEsat Project; Address1: Room 419; Address2: School of EE&T; Address3: UNSW, NSW 2052; Address4: Australia; DocumentNumber: COMS0004; SheetNumber: 1; SheetTotal: 4; Description: Overview of Switching Circuit; Version: 1.0
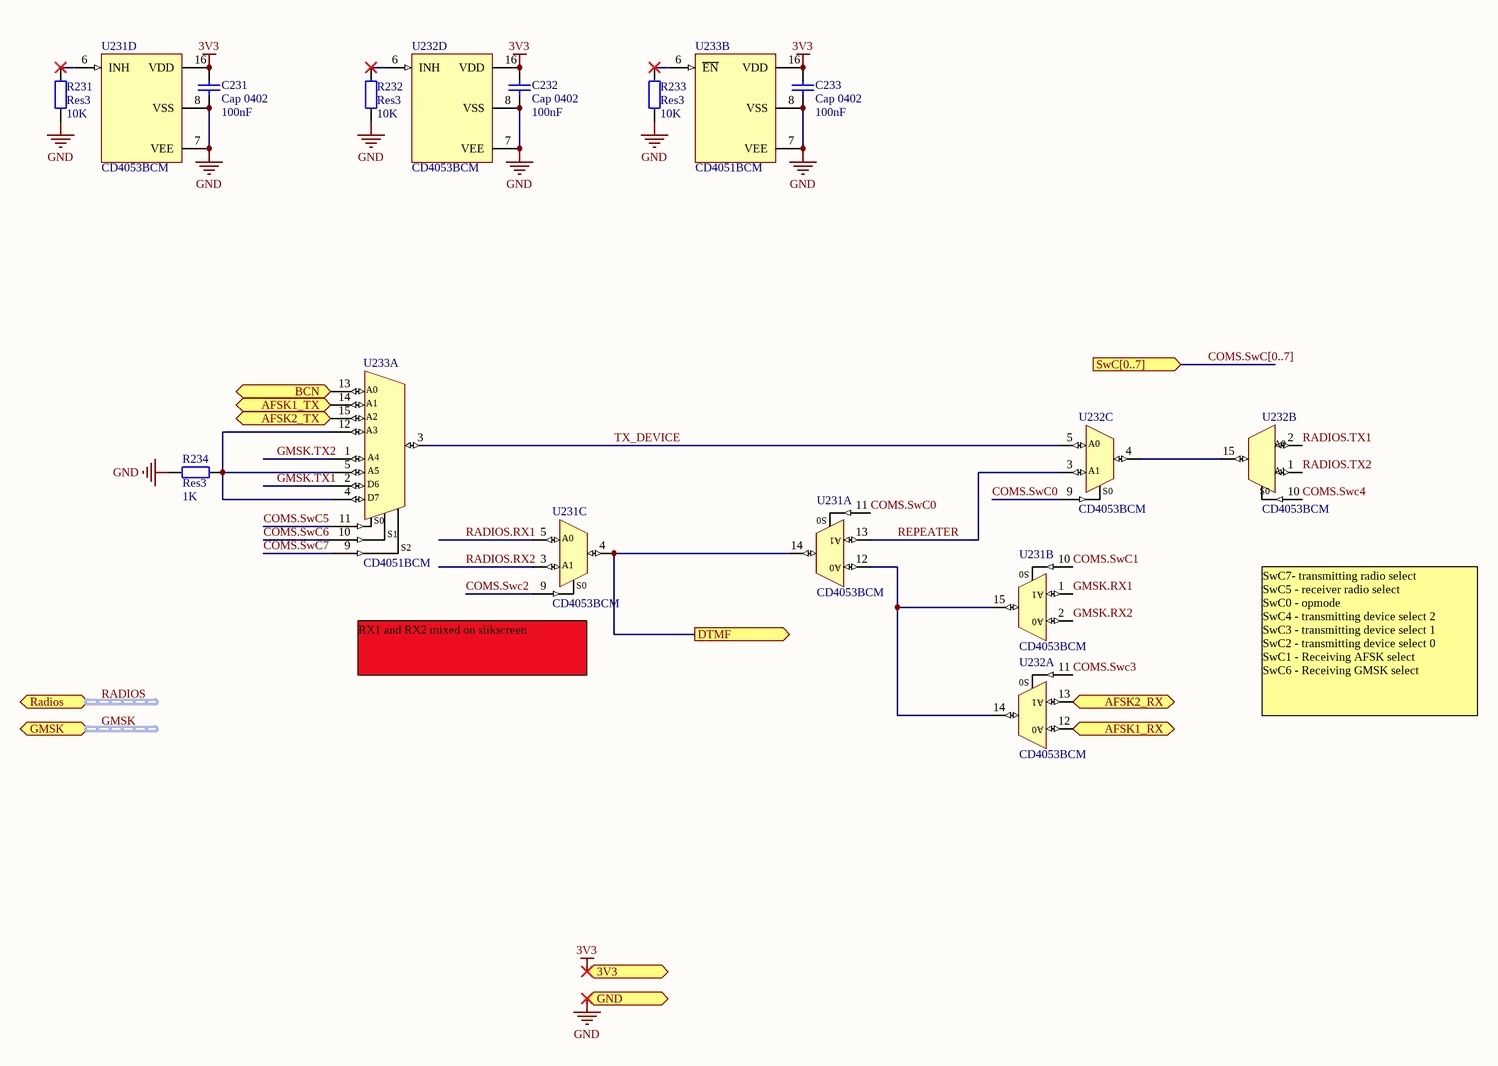
[diagram p5: COMS0004 SwC_Main.SchDoc]

### Parts
C231  Cap 0402  value 100nF  [CAPC1005X06L]
C232  Cap 0402  value 100nF  [CAPC1005X06L]
C233  Cap 0402  value 100nF  [CAPC1005X06L]
R231  Res3  value 10K  [RESC1005X06L]
R232  Res3  value 10K  [RESC1005X06L]
R233  Res3  value 10K  [RESC1005X06L]
R234  Res3  value 1K  [RESC1005X06L]
U231  CD4053BCM  [TSSOP16]  (parts A,B,C,D of 4)
U232  CD4053BCM  [TSSOP16]  (parts A,B,C,D of 4)
U233  CD4051BCM  [TSSOP16]  (parts A,B of 2)

### Ports
3V3 (in), AFSK1_RX (out), AFSK1_TX (in), AFSK2_RX (out), AFSK2_TX (in), BCN (in), DTMF (out), GMSK (harness GMSK), GND (in), Radios (harness RADIOS), SwC[0..7] (in)

### Nets
3V3: C231.2 C232.2 C233.2 U231.16(VDD) U232.16(VDD) U233.16(VDD) ; port 3V3
GND: C231.1 C232.1 C233.1 R231.2 R232.2 R233.2 R234.1 U231.7(VEE) U231.8(VSS) U232.7(VEE) U232.8(VSS) U233.7(VEE) U233.8(VSS) ; port GND
AFSK1_RX: U232.12(A0) ; port AFSK1_RX
AFSK1_TX: U233.14(A1) ; port AFSK1_TX
AFSK2_RX: U232.13(A1) ; port AFSK2_RX
AFSK2_TX: U233.15(A2) ; port AFSK2_TX
BCN: U233.13(A0) ; port BCN
COMS.SwC0: U231.11(A) U232.9(C)  [project net Control.SwC0]
COMS.SwC1: U231.10(B)  [project net Control.SwC1]
COMS.Swc2: U231.9(C)  [project net Control.SwC2]
COMS.Swc3: U232.11(A)  [project net Control.SwC3]
COMS.Swc4: U232.10(B)  [project net Control.SwC4]
COMS.SwC5: U233.11(S0)  [project net Control.SwC5]
COMS.SwC6: U233.10(S1)  [project net Control.SwC6]
COMS.SwC7: U233.9(S2)  [project net Control.SwC7]
DTMF_RX: U231.4(c_out) U231.14(A_out) ; port DTMF
GMSK.RX1: U231.1(by)
GMSK.RX2: U231.2(bx)
GMSK.TX1: U233.2(A6)
GMSK.TX2: U233.1(A4)
RADIOS.RX1: U231.5(cx)
RADIOS.RX2: U231.3(cy)
RADIOS.TX1: U232.2(bx)
RADIOS.TX2: U232.1(by)
REPEATER: U231.13(A1) U232.3(cy)
TX_DEVICE: U232.5(cx) U233.3(O)
NetR231_1: R231.1 U231.6(INH)
NetR232_1: R232.1 U232.6(INH)
NetR233_1: R233.1 U233.6(~{EN})
NetR234_2: R234.2 U233.4(A7) U233.5(A5) U233.12(A3)
NetU231_12: U231.12(A0) U231.15(b_out) U232.14(A_out)
NetU232_4: U232.4(c_out) U232.15(b_out)

### Buses and harness runs
bus COMS.SwC[0..7] = port SwC[0..7]
harness GMSK = port GMSK
harness RADIOS = port Radios

### Notes on the sheet
- (near U231) RX1 and RX2 mixed on slikscreen
- SwC7- transmitting radio select
  SwC5 - receiver radio select
  SwC0 - opmode
  SwC4 - transmitting device select 2
  SwC3 - transmitting device select 1
  SwC2 - transmitting device select 0
  SwC1 - Receiving AFSK select
  SwC6 - Receiving GMSK select
- Title
- Description:
- Size:
- Author:
- Date:
- A3
- Time:
- Version
- Sheet:
- Drawing No.:
- of
- File:
- (in symbol CD4051BCM, part A) D6; D7
- (in symbol CD4053BCM, part A) S0
- (in symbol CD4053BCM, part B) S0
- (in symbol CD4053BCM, part C) S0

### Library data of the parts
C231-C233 = Cap 0402: Capacitor; Published: 8-Jun-2000; LatestRevisionDate: 17-Jul-2002; LatestRevisionNote: Re-released for DXP Platform.; PackageReference: RAD-0.3; Publisher: Altium Limited; PackageDescription: Radial Cap, Thru-Hole; 2 Leads; 0.3 in Pin Spacing
R231-R234 = Res3: Resistor; Published: 8-Jun-2000; LatestRevisionDate: 29-May-2009; LatestRevisionNote: IPC-7351 Footprint Added.; PackageReference: J1-0603; Publisher: Altium Limited; PackageDescription: Chip Resistor
U231 U232 = CD4053BCM: Triple 2-Channnel Analog Multiplexer/Demutiplexer; Supplier 1: Farnell; Supplier Part Number 1: 2132284
U233 = CD4051BCM: 8-Channel Analog Multiplexer/Demultiplexer; Datasheet Link: http://focus.ti.com/lit/ds/symlink/cd4052b.pdf; Supplier 1: Farnell; Supplier Part Number 1: 1753421

## Sheet COMS0002_AFSK.SchDoc: BLUEsat AFSK Modem
size A3; DrawnBy: Mitch Wenke, Chris Webb, Thomas Fisk; Engineer: C. WEBB, M. WENKE; Organization: BLUEsat Project; Address1: Room 419; Address2: School of EE&T; Address3: UNSW, NSW 2052; Address4: Australia; DocumentNumber: COMS0002; SheetNumber: 1; SheetTotal: 1; Description: AFSK modem based on CML MX614 IC; Version: 1.0
Used 2 times, as channels COMS0013/A1, COMS0013/A2. Parts and nets are listed once, with the designators drawn on the sheet.
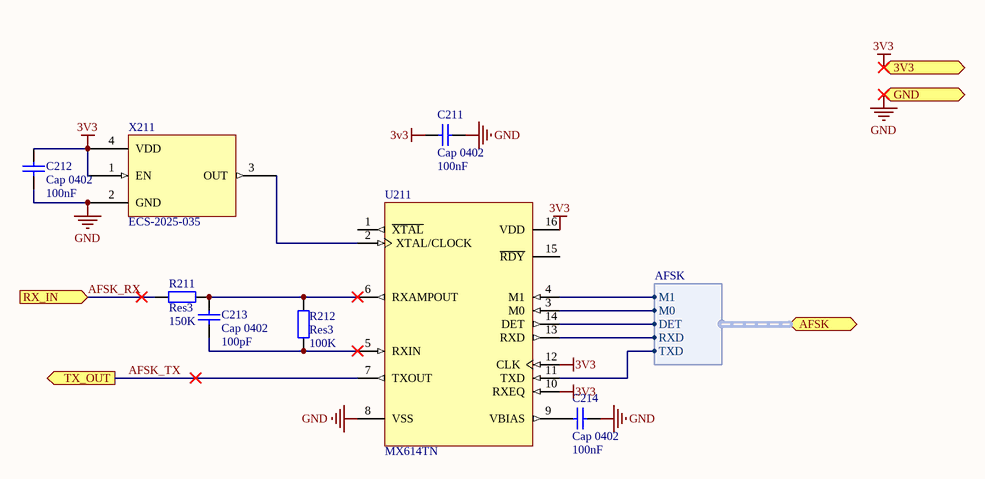
[diagram p6: COMS0002_AFSK.SchDoc]

### Parts
C211  Cap 0402  value 100nF  [CAPC1005X06L]
C212  Cap 0402  value 100nF  [CAPC1005X06L]
C213  Cap 0402  value 100pF  [CAPC1005X06L]
C214  Cap 0402  value 100nF  [CAPC1005X06L]
R211  Res3  value 150K  [RESC1005X06L]
R212  Res3  value 100K  [RESC1005X06L]
U211  MX614TN  [SOIC16]
X211  ECS-2025-035  [ECS-2025]

### Ports
3V3 (in), AFSK (harness AFSK), GND (in), RX_IN (in), TX_OUT (out)

### Harnesses
AFSK: DET, M0, M1, RXD, TXD

### Nets
3V3: C211.2 C212.2 U211.10(RXEQ) U211.12(CLK) U211.16(VDD) X211.1(EN) X211.4(VDD) ; port 3V3
GND: C211.1 C212.1 C214.1 U211.8(VSS) X211.2(GND) ; port GND
AFSK_RX: R211.2 ; port RX_IN
AFSK_TX: U211.7(TXOUT) ; port TX_OUT
NetC213_1: C213.1 R212.2 U211.5(RXIN)
NetC213_2: C213.2 R211.1 R212.1 U211.6(RXAMPOUT)
NetC214_2: C214.2 U211.9(VBIAS)
NetU211_2: U211.2(XTAL/CLOCK) X211.3(OUT)
NetU211_3: U211.3(M0) ; port AFSK.M0
NetU211_4: U211.4(M1) ; port AFSK.M1
NetU211_11: U211.11(TXD) ; port AFSK.TXD
NetU211_13: U211.13(RXD) ; port AFSK.RXD
NetU211_14: U211.14(DET) ; port AFSK.DET

Not connected (* = marked no-connect by the designer): U211 1(~{XTAL}) 15(~{RDY})

### Channels
COMS0013/A1: designators end in .A; ports 3V3=3V3 GND=GND RX_IN=AFSK1_RX TX_OUT=AFSK1_TX
COMS0013/A2: designators end in .B; ports 3V3=3V3 GND=GND RX_IN=AFSK2_RX TX_OUT=AFSK2_TX

### Notes on the sheet
- Title
- Description:
- Size:
- Author:
- Date:
- A3
- Time:
- Version
- Sheet:
- Drawing No.:
- of
- File:

### Library data of the parts
C211-C214 = Cap 0402: Capacitor; Published: 8-Jun-2000; LatestRevisionDate: 17-Jul-2002; LatestRevisionNote: Re-released for DXP Platform.; PackageReference: RAD-0.3; Publisher: Altium Limited; PackageDescription: Radial Cap, Thru-Hole; 2 Leads; 0.3 in Pin Spacing
R211 R212 = Res3: Resistor; Published: 8-Jun-2000; LatestRevisionDate: 29-May-2009; LatestRevisionNote: IPC-7351 Footprint Added.; PackageReference: J1-0603; Publisher: Altium Limited; PackageDescription: Chip Resistor
U211 = MX614TN: Bell 202 Compatible Modem
X211 = ECS-2025-035: SMD Clock Oscillator, 3.579545MHz

## Sheet CSC Connections Temp.SchDoc
size A4
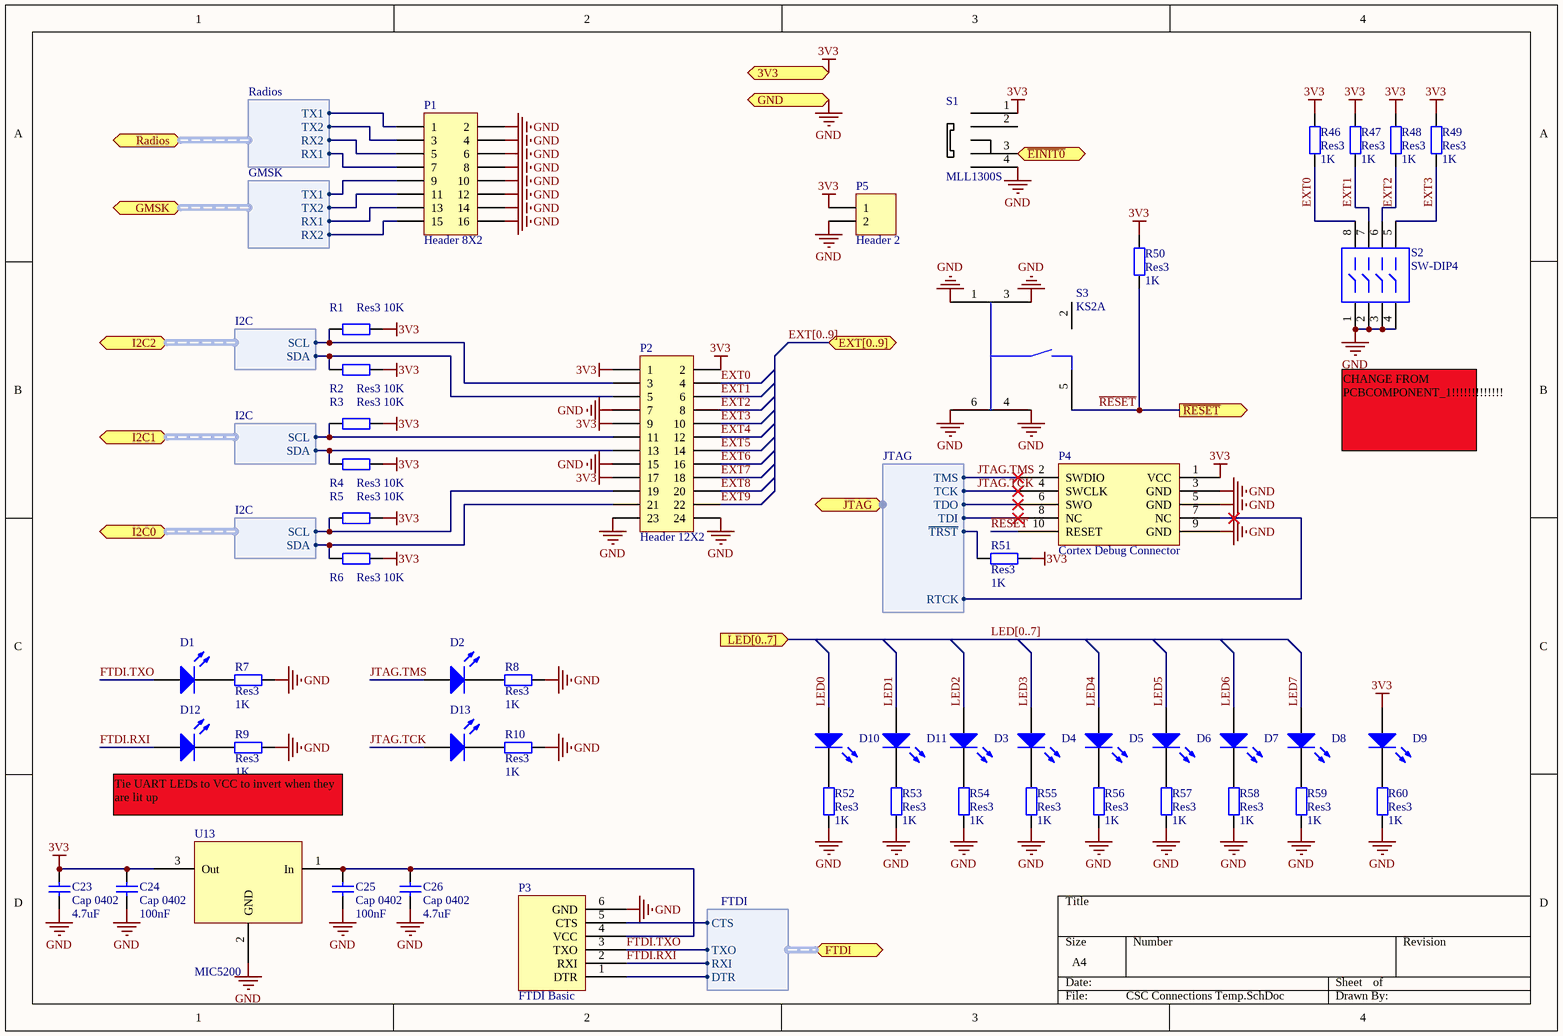
[diagram p7: CSC Connections Temp.SchDoc]

### Parts
C23  Cap 0402  value 4.7uF  [CAPC1005X06L]
C24  Cap 0402  value 100nF  [CAPC1005X06L]
C25  Cap 0402  value 100nF  [CAPC1005X06L]
C26  Cap 0402  value 4.7uF  [CAPC1005X06L]
D1  LED - ASMT-Rx45  [ASMT-Rx45]  (value not drawn)
D2  LED - ASMT-Rx45  [ASMT-Rx45]  (value not drawn)
D3  LED - ASMT-Rx45  [ASMT-Rx45]  (value not drawn)
D4  LED - ASMT-Rx45  [ASMT-Rx45]  (value not drawn)
D5  LED - ASMT-Rx45  [ASMT-Rx45]  (value not drawn)
D6  LED - ASMT-Rx45  [ASMT-Rx45]  (value not drawn)
D7  LED - ASMT-Rx45  [ASMT-Rx45]  (value not drawn)
D8  LED - ASMT-Rx45  [ASMT-Rx45]  (value not drawn)
D9  LED - ASMT-Rx45  [ASMT-Rx45]  (value not drawn)
D10  LED - ASMT-Rx45  [ASMT-Rx45]  (value not drawn)
D11  LED - ASMT-Rx45  [ASMT-Rx45]  (value not drawn)
D12  LED - ASMT-Rx45  [ASMT-Rx45]  (value not drawn)
D13  LED - ASMT-Rx45  [ASMT-Rx45]  (value not drawn)
P1  Header 8X2  [HDR2X8]
P2  Header 12X2  [HDR2X12]
P3  FTDI Basic  [FTDI BASIC]
P4  Cortex Debug Connector  [FTSH-105-01-L-DV-TR]
P5  Header 2  [HDR1X2]
R1  Res3  value 10K  [RESC1005X06L]
R2  Res3  value 10K  [RESC1005X06L]
R3  Res3  value 10K  [RESC1005X06L]
R4  Res3  value 10K  [RESC1005X06L]
R5  Res3  value 10K  [RESC1005X06L]
R6  Res3  value 10K  [RESC1005X06L]
R7  Res3  value 1K  [RESC1005X06L]
R8  Res3  value 1K  [RESC1005X06L]
R9  Res3  value 1K  [RESC1005X06L]
R10  Res3  value 1K  [RESC1005X06L]
R46  Res3  value 1K  [RESC1005X06L]
R47  Res3  value 1K  [RESC1005X06L]
R48  Res3  value 1K  [RESC1005X06L]
R49  Res3  value 1K  [RESC1005X06L]
R50  Res3  value 1K  [RESC1005X06L]
R51  Res3  value 1K  [RESC1005X06L]
R52  Res3  value 1K  [RESC1005X06L]
R53  Res3  value 1K  [RESC1005X06L]
R54  Res3  value 1K  [RESC1005X06L]
R55  Res3  value 1K  [RESC1005X06L]
R56  Res3  value 1K  [RESC1005X06L]
R57  Res3  value 1K  [RESC1005X06L]
R58  Res3  value 1K  [RESC1005X06L]
R59  Res3  value 1K  [RESC1005X06L]
R60  Res3  value 1K  [RESC1005X06L]
S1  MLL1300S  [MILL1300S]
S2  SW-DIP4  [PCBComponent_1]
S3  KS2A  [K5A2]
U13  MIC5200  [SOT230P710X170-4L]

### Ports
3V3 (in), EXT[0..9] (bidir), FTDI (harness FTDI), GMSK (harness GMSK), GND (in), I2C0 (harness I2C), I2C1 (harness I2C), I2C2 (harness I2C), JTAG (harness JTAG), LED[0..7] (in), Radios (harness Radios), ~{EINIT0} (out), ~{RESET} (out)

### Harnesses
JTAG: RTCK, ~{TRST}, TCK, TDI, TDO, TMS
FTDI: DTR, RXI, TXO, CTS
I2C: SCL, SDA
GMSK: RX1, RX2, TX1, TX2
Radios: RX1, RX2, TX1, TX2

### Nets
3V3: C23.2 C24.2 D9.1(A) P2.1 P2.2 P2.9 P2.17 P4.1(VCC) P5.1 R1.2 R2.2 R3.2 R4.2 R5.2 R6.2 R46.1 R47.1 R48.1 R49.1 R50.1 R51.2 S1.1 U13.3(Out) ; port 3V3
GND: C23.1 C24.1 C25.1 C26.1 P1.2 P1.4 P1.6 P1.8 P1.10 P1.12 P1.14 P1.16 P2.7 P2.15 P2.23 P2.24 P3.6(GND) P4.3(GND) P4.5(GND) P4.9(GND) P5.2 R7.2 R8.2 R9.2 R10.2 R52.2 R53.2 R54.2 R55.2 R56.2 R57.2 R58.2 R59.2 R60.2 S1.4 S2.1 S2.2 S2.3 S2.4 S3.1 S3.3 S3.4 S3.6 U13.2(GND) ; port GND
~{EINIT0}: S1.3 ; port ~{EINIT0}
EXT0: P2.4 R46.2 S2.8
EXT1: P2.6 R47.2 S2.7
EXT2: P2.8 R48.2 S2.6
EXT3: P2.10 R49.2 S2.5
EXT4: P2.12
EXT5: P2.14
EXT6: P2.16
EXT7: P2.18
EXT8: P2.20
EXT9: P2.22
FTDI.CTS: P3.5(CTS) ; port FTDI.CTS
FTDI.DTR: P3.1(DTR) ; port FTDI.DTR
FTDI.RXI: D12.1(A) P3.2(RXI) ; port FTDI.RXI
FTDI.TXO: D1.1(A) P3.3(TXO) ; port FTDI.TXO
GMSK.RX1: P1.13 ; port GMSK.RX1
GMSK.RX2: P1.15 ; port GMSK.RX2
GMSK.TX1: P1.9 ; port GMSK.TX1
GMSK.TX2: P1.11 ; port GMSK.TX2
I2C0.SCL: P2.19 R5.1 ; port I2C0.SCL
I2C0.SDA: P2.21 R6.1 ; port I2C0.SDA
I2C1.SCL: P2.11 R3.1 ; port I2C1.SCL
I2C1.SDA: P2.13 R4.1 ; port I2C1.SDA
I2C2.SCL: P2.3 R1.1 ; port I2C2.SCL
I2C2.SDA: P2.5 R2.1 ; port I2C2.SDA
JTAG.RTCK: P4.7(NC) ; port JTAG.RTCK
JTAG.~{TRST}: R51.1 ; port JTAG.~{TRST}
JTAG.TCK: D13.1(A) P4.4(SWCLK) ; port JTAG.TCK
JTAG.TDI: P4.8(NC) ; port JTAG.TDI
JTAG.TDO: P4.6(SWO) ; port JTAG.TDO
JTAG.TMS: D2.1(A) P4.2(SWDIO) ; port JTAG.TMS
LED0: D10.1(A)
LED1: D11.1(A)
LED2: D3.1(A)
LED3: D4.1(A)
LED4: D5.1(A)
LED5: D6.1(A)
LED6: D7.1(A)
LED7: D8.1(A)
~{RESET}: P4.10(RESET) R50.2 S3.5 ; port ~{RESET}
Radios.RX1: P1.7 ; port Radios.RX1
Radios.RX2: P1.5 ; port Radios.RX2
Radios.TX1: P1.1 ; port Radios.TX1
Radios.TX2: P1.3 ; port Radios.TX2
NetC25_2: C25.2 C26.2 P3.4(VCC) U13.1(In)
NetD1_2: D1.2(K) R7.1
NetD2_2: D2.2(K) R8.1
NetD3_2: D3.2(K) R54.1
NetD4_2: D4.2(K) R55.1
NetD5_2: D5.2(K) R56.1
NetD6_2: D6.2(K) R57.1
NetD7_2: D7.2(K) R58.1
NetD8_2: D8.2(K) R59.1
NetD9_2: D9.2(K) R60.1
NetD10_2: D10.2(K) R52.1
NetD11_2: D11.2(K) R53.1
NetD12_2: D12.2(K) R9.1
NetD13_2: D13.2(K) R10.1

Not connected (* = marked no-connect by the designer): S1 2; S3 2

### Buses and harness runs
bus EXT[0..9] = port EXT[0..9]
bus LED[0..7] = port LED[0..7]

### Notes on the sheet
- CHANGE FROM PCBCOMPONENT_1!!!!!!!!!!!!!
- Tie UART LEDs to VCC to invert when they are lit up

### Library data of the parts
C23-C26 = Cap 0402: Capacitor; Published: 8-Jun-2000; LatestRevisionDate: 17-Jul-2002; LatestRevisionNote: Re-released for DXP Platform.; PackageReference: RAD-0.3; Publisher: Altium Limited; PackageDescription: Radial Cap, Thru-Hole; 2 Leads; 0.3 in Pin Spacing
D1-D13 = LED: Typical INFRARED GaAs LED 0603; Published: 8-Jun-2000; LatestRevisionDate: 08-Jul-2005; LatestRevisionNote: Mech Layer 1 removed.; PackageReference: LED-0; Publisher: Altium Limited; PackageDescription: LED; 2 Leads
P1 = Header 8X2: Header, 8-Pin, Dual row; LatestRevisionDate: 17-Jul-2002; LatestRevisionNote: Re-released for DXP Platform.; Publisher: Altium Limited
P2 = Header 12X2: Header, 12-Pin, Dual row; LatestRevisionDate: 17-Jul-2002; LatestRevisionNote: Re-released for DXP Platform.; Publisher: Altium Limited
P4 = Cortex Debug Connector: Mates with FFSD-05-D-12.00-01-N
P5 = Header 2: Header, 2-Pin; LatestRevisionDate: 17-Jul-2002; LatestRevisionNote: Re-released for DXP Platform.; Publisher: Altium Limited
R1-R10 R46-R60 = Res3: Resistor; Published: 8-Jun-2000; LatestRevisionDate: 29-May-2009; LatestRevisionNote: IPC-7351 Footprint Added.; PackageReference: J1-0603; Publisher: Altium Limited; PackageDescription: Chip Resistor
S1 = MLL1300S: Slide switch SP3T switch
S2 = SW-DIP4: DIP Switch - 1571983-5; Published: 24-Mar-1999; LatestRevisionDate: 17-Jul-2002; LatestRevisionNote: Re-released for DXP Platform.; PackageReference: DIP-8; Publisher: Altium Limited
S3 = KS2A: Tact Switch

## Nets that join several sheets
3V3: CRSC0002 (40 pins), COMS0013/D1 (7 pins), COMS0013/D2 (7 pins), COMS0001_Beacon (9 pins), COMS0004 SwC_Main (6 pins), COMS0013/A1 (7 pins), COMS0013/A2 (7 pins), CSC Connections Temp (23 pins)
GND: CRSC0002 (44 pins), COMS0013/D1 (6 pins), COMS0013/D2 (6 pins), COMS0001_Beacon (22 pins), COMS0004 SwC_Main (13 pins), COMS0013/A1 (5 pins), COMS0013/A2 (5 pins), CSC Connections Temp (44 pins)
AFSK1_RX: COMS0004 SwC_Main (U232.12), COMS0013/A1 (R211.A.2)
AFSK1_TX: COMS0004 SwC_Main (U233.14), COMS0013/A1 (U211.A.7)
AFSK2_RX: COMS0004 SwC_Main (U232.13), COMS0013/A2 (R211.B.2)
AFSK2_TX: COMS0004 SwC_Main (U233.15), COMS0013/A2 (U211.B.7)
BCN: COMS0001_Beacon (R201.1 U202.5), COMS0004 SwC_Main (U233.13)
Control.SwC0: CRSC0002 (U101.108), COMS0004 SwC_Main (U231.11 U232.9)
Control.SwC1: CRSC0002 (U101.106), COMS0004 SwC_Main (U231.10)
Control.SwC2: CRSC0002 (U101.102), COMS0004 SwC_Main (U231.9)
Control.SwC3: CRSC0002 (U101.99), COMS0004 SwC_Main (U232.11)
Control.SwC4: CRSC0002 (U101.95), COMS0004 SwC_Main (U232.10)
Control.SwC5: CRSC0002 (U101.82), COMS0004 SwC_Main (U233.11)
Control.SwC6: CRSC0002 (U101.81), COMS0004 SwC_Main (U233.10)
Control.SwC7: CRSC0002 (U101.80), COMS0004 SwC_Main (U233.9)
DTMF.STD: CRSC0002 (U101.154), COMS0013/D2 (U221.B.17)
DTMF.STD: CRSC0002 (U101.140), COMS0013/D1 (U221.A.17)
DTMF_RX: COMS0013/D1 (C221.A.2), COMS0013/D2 (C221.B.2), COMS0004 SwC_Main (U231.4 U231.14)
~{EINIT0}: CRSC0002 (U101.110), CSC Connections Temp (S1.3)
EXT0: CRSC0002 (U101.78), CSC Connections Temp (P2.4 R46.2 S2.8)
EXT1: CRSC0002 (U101.76), CSC Connections Temp (P2.6 R47.2 S2.7)
EXT2: CRSC0002 (U101.74), CSC Connections Temp (P2.8 R48.2 S2.6)
EXT3: CRSC0002 (U101.73), CSC Connections Temp (P2.10 R49.2 S2.5)
EXT4: CRSC0002 (U101.72), CSC Connections Temp (P2.12)
EXT5: CRSC0002 (U101.70), CSC Connections Temp (P2.14)
EXT6: CRSC0002 (U101.69), CSC Connections Temp (P2.16)
EXT7: CRSC0002 (U101.68), CSC Connections Temp (P2.18)
EXT8: CRSC0002 (U101.67), CSC Connections Temp (P2.20)
EXT9: CRSC0002 (U101.66), CSC Connections Temp (P2.22)
FTDI.RXI: CRSC0002 (U101.202), CSC Connections Temp (D12.1 P3.2)
FTDI.TXO: CRSC0002 (U101.204), CSC Connections Temp (D1.1 P3.3)
I2C0.SCL: CRSC0002 (U101.48), CSC Connections Temp (P2.19 R5.1)
I2C0.SDA: CRSC0002 (U101.50), CSC Connections Temp (P2.21 R6.1)
I2C1.SCL: CRSC0002 (U101.96), CSC Connections Temp (P2.11 R3.1)
I2C1.SDA: CRSC0002 (U101.94), CSC Connections Temp (P2.13 R4.1)
I2C2.SCL: CRSC0002 (U101.100), CSC Connections Temp (P2.3 R1.1)
I2C2.SDA: CRSC0002 (U101.98), CSC Connections Temp (P2.5 R2.1)
JTAG.RTCK: CRSC0002 (R103.1 U101.206), CSC Connections Temp (P4.7)
JTAG.~{TRST}: CRSC0002 (U101.8), CSC Connections Temp (R51.1)
JTAG.TCK: CRSC0002 (R104.1 U101.10), CSC Connections Temp (D13.1 P4.4)
JTAG.TDI: CRSC0002 (U101.4), CSC Connections Temp (P4.8)
JTAG.TDO: CRSC0002 (U101.2), CSC Connections Temp (P4.6)
JTAG.TMS: CRSC0002 (U101.6), CSC Connections Temp (D2.1 P4.2)
LED0: CRSC0002 (U101.65), CSC Connections Temp (D10.1)
LED1: CRSC0002 (U101.64), CSC Connections Temp (D11.1)
LED2: CRSC0002 (U101.59), CSC Connections Temp (D3.1)
LED3: CRSC0002 (U101.58), CSC Connections Temp (D4.1)
LED4: CRSC0002 (U101.57), CSC Connections Temp (D5.1)
LED5: CRSC0002 (U101.56), CSC Connections Temp (D6.1)
LED6: CRSC0002 (U101.55), CSC Connections Temp (D7.1)
LED7: CRSC0002 (U101.54), CSC Connections Temp (D8.1)
NetU101_116: CRSC0002 (U101.116), COMS0013/A1 (U211.A.4)
NetU101_118: CRSC0002 (U101.118), COMS0013/A1 (U211.A.3)
NetU101_120: CRSC0002 (U101.120), COMS0013/A1 (U211.A.14)
NetU101_122: CRSC0002 (U101.122), COMS0013/A2 (U211.B.4)
NetU101_124: CRSC0002 (U101.124), COMS0013/A2 (U211.B.3)
NetU101_126: CRSC0002 (U101.126), COMS0013/A2 (U211.B.14)
NetU101_128: CRSC0002 (U101.128), COMS0013/A2 (U211.B.11)
NetU101_130: CRSC0002 (U101.130), COMS0013/A2 (U211.B.13)
~{RESET}: CRSC0002 (R102.1 U101.35), CSC Connections Temp (P4.10 R50.2 S3.5)